# EAGLE design Cell Module v1 (EAGLE 8.2.2)
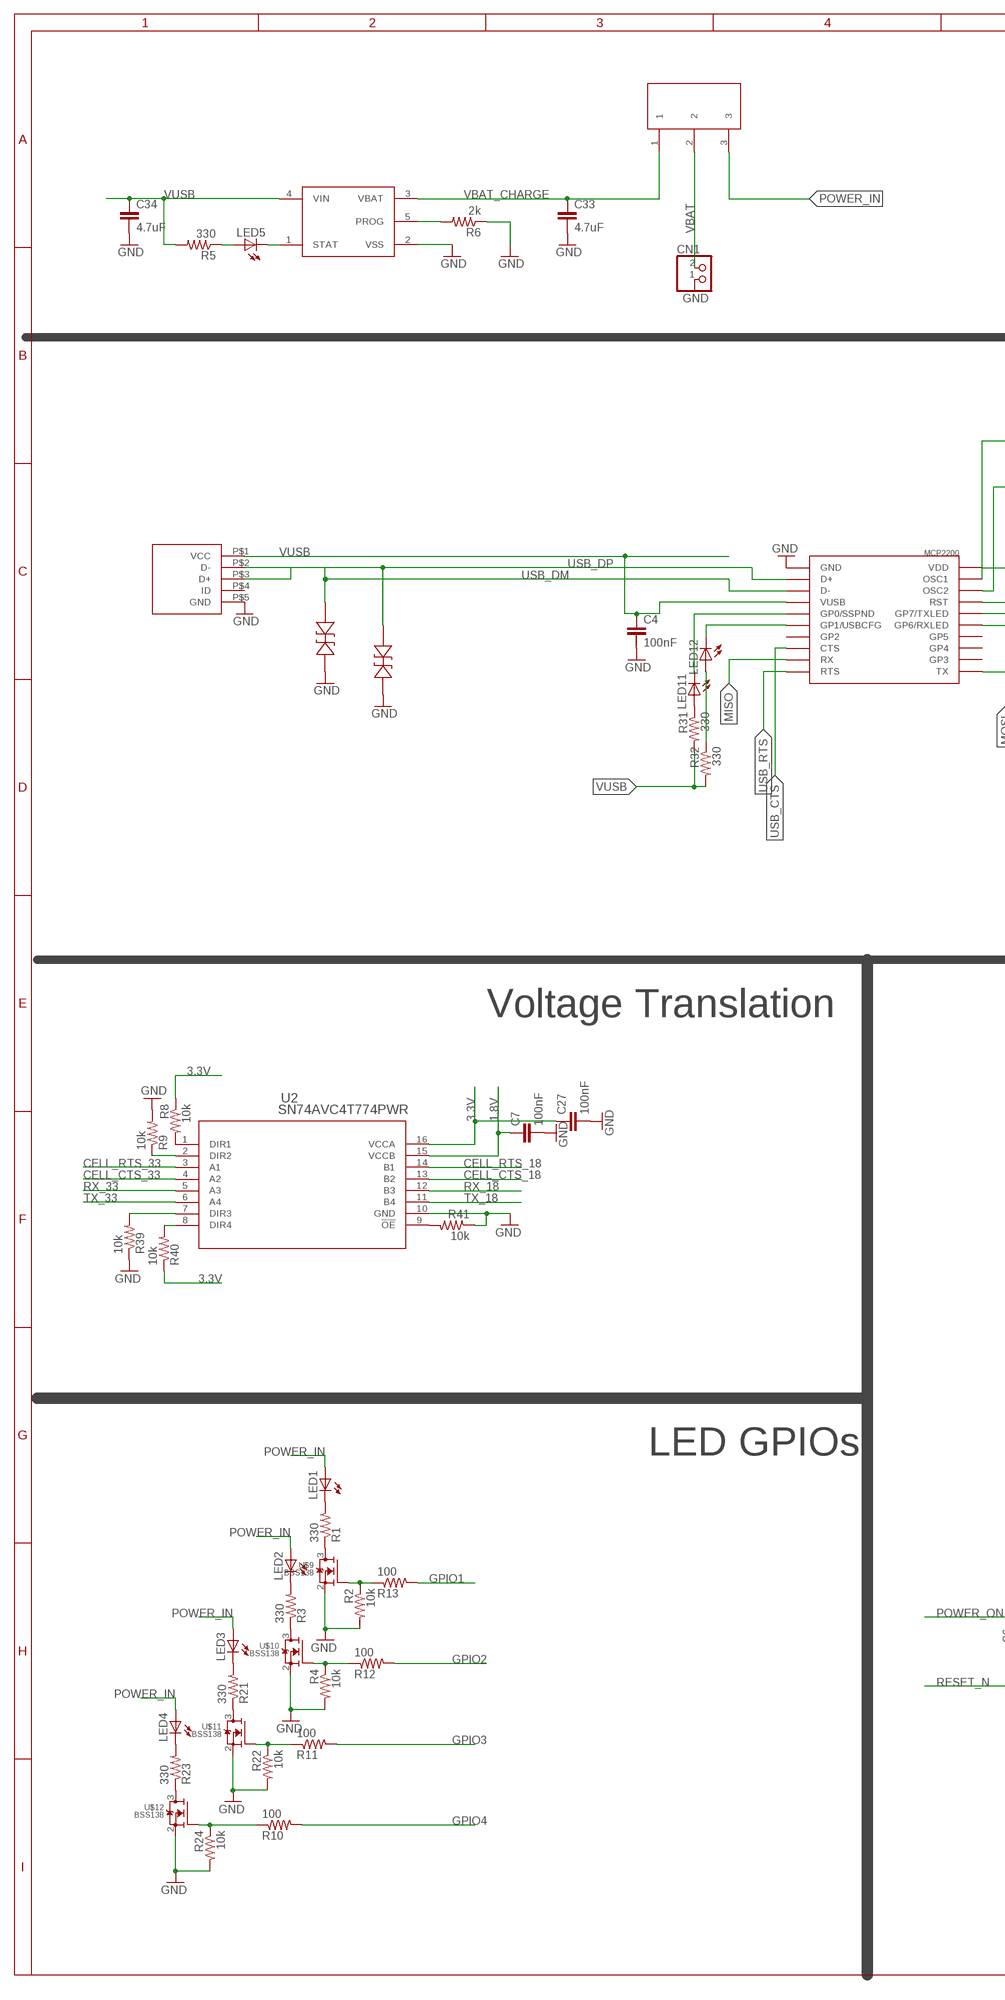
[diagram p0: schematic, sheet 1, part 1 of 2]
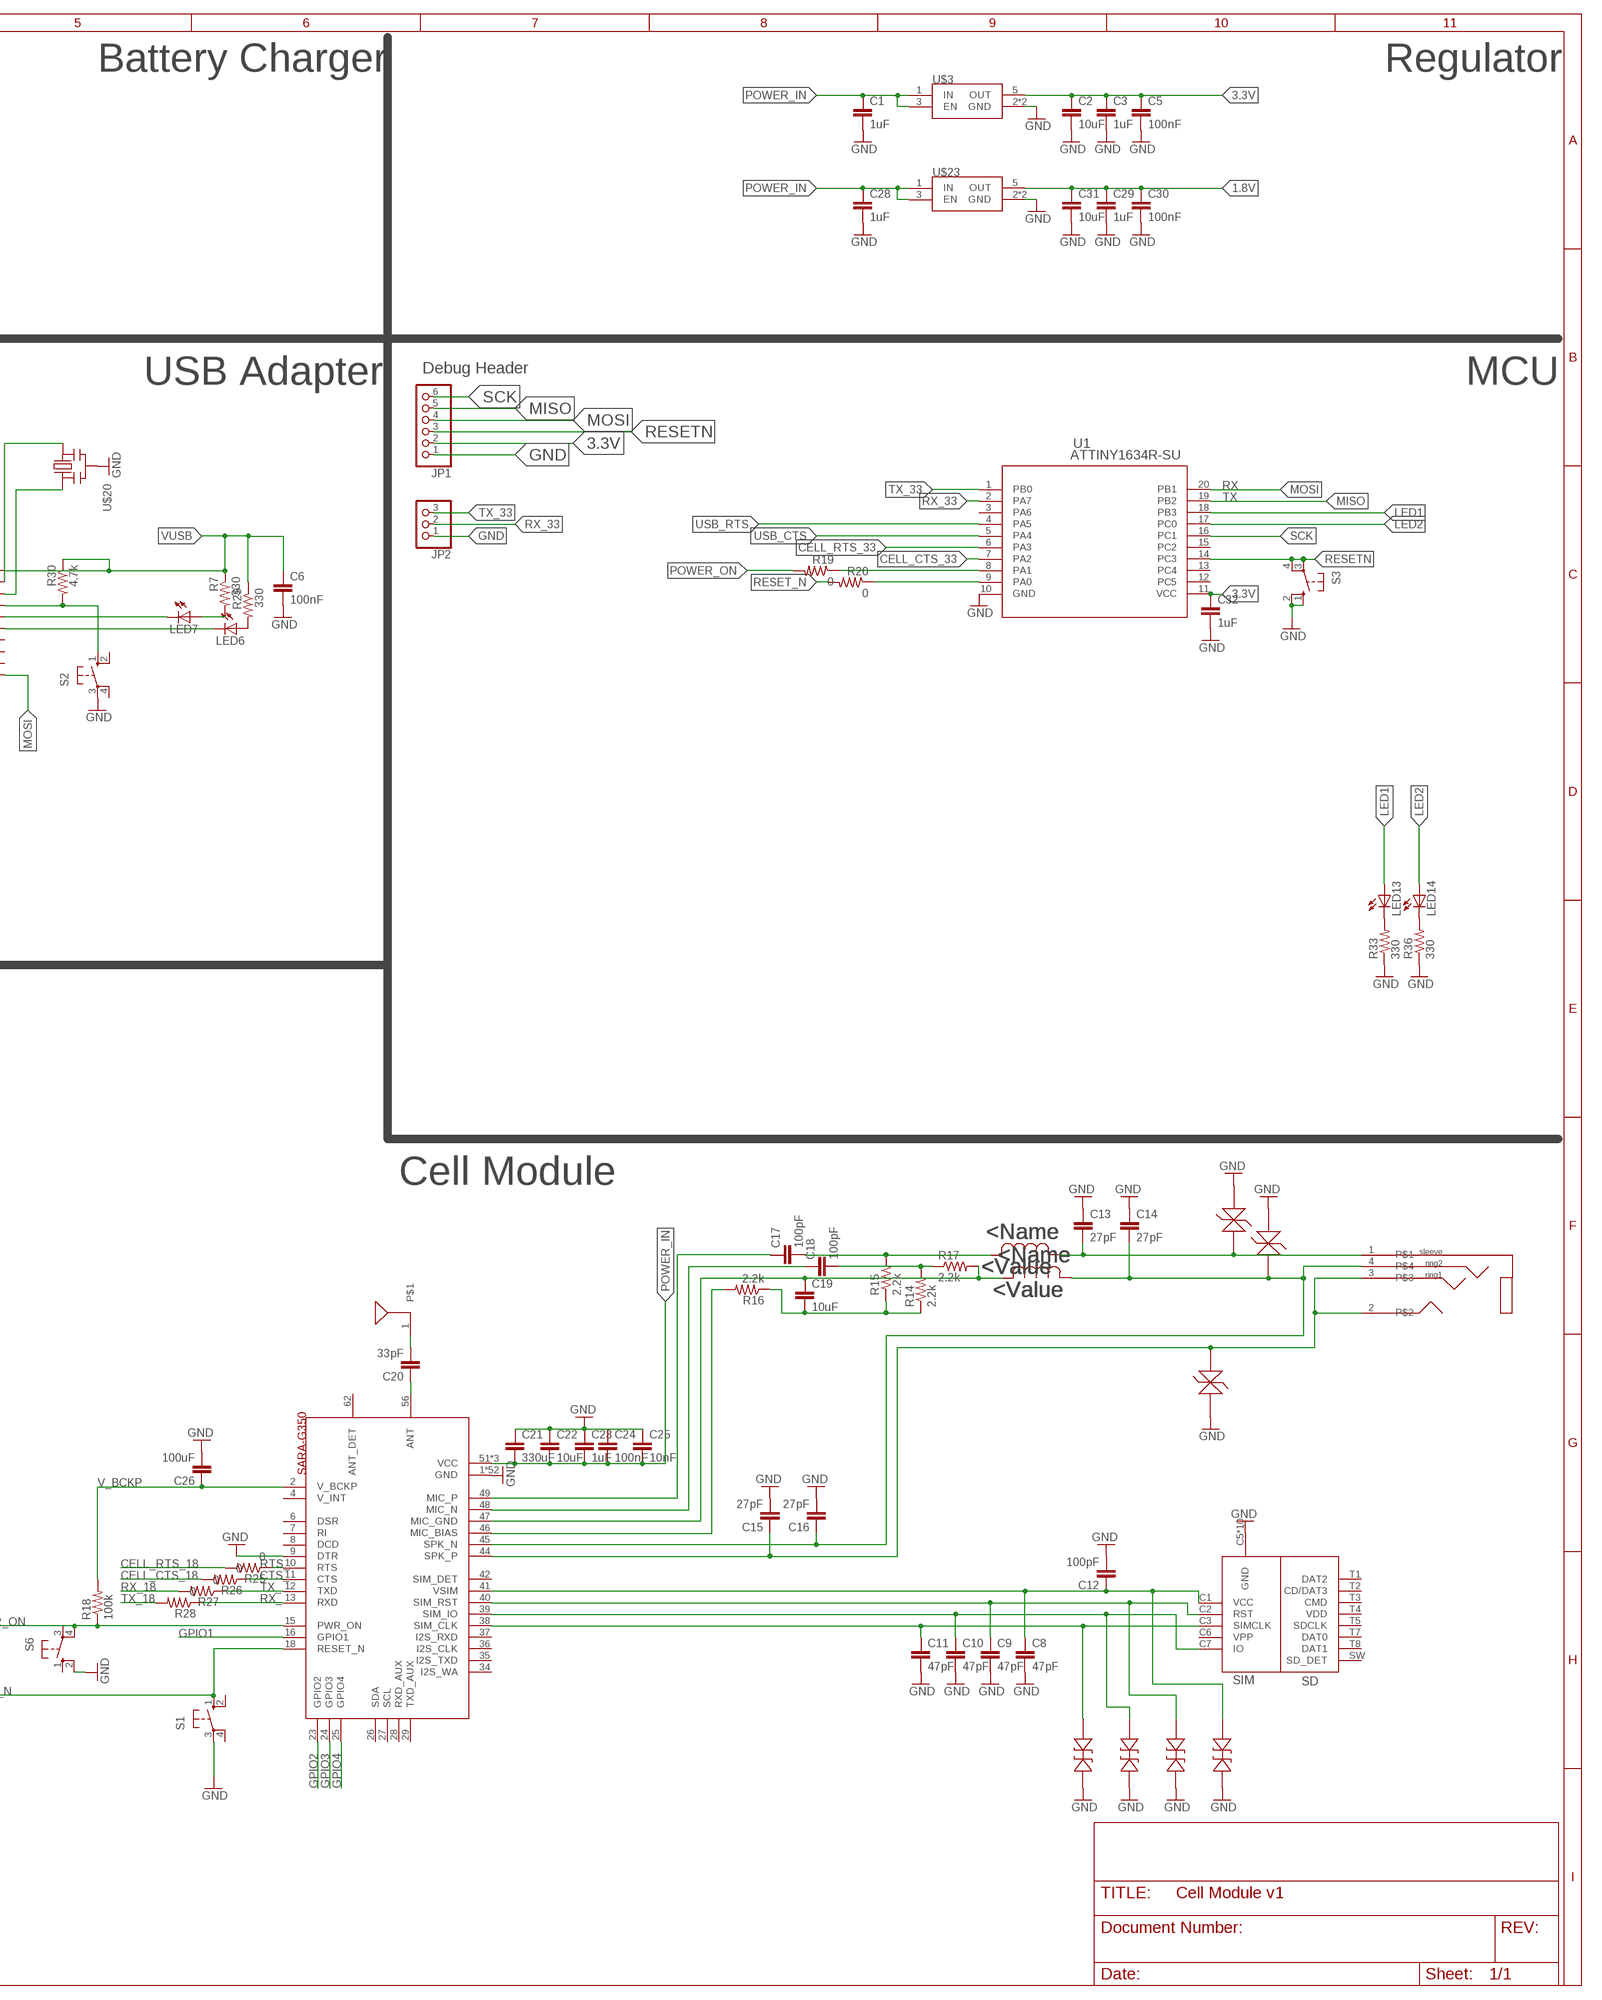
[diagram p1: schematic, sheet 1, part 2 of 2]

## Parts
C1  1uF  C-EUC0402  [C0402]
C2  10uF  C-EUC0603  [C0603]
C3  1uF  C-EUC0402  [C0402]
C4  100nF  C-EUC0402  [C0402]
C5  100nF  C-EUC0402  [C0402]
C6  100nF  C-EUC0402  [C0402]
C7  100nF  C-EUC0402  [C0402]
C8  47pF  C-EUC0402  [C0402]
C9  47pF  C-EUC0402  [C0402]
C10  47pF  C-EUC0402  [C0402]
C11  47pF  C-EUC0402  [C0402]
C12  100pF  C-EUC0402  [C0402]
C13  27pF  C-EUC0402  [C0402]
C14  27pF  C-EUC0402  [C0402]
C15  27pF  C-EUC0402  [C0402]
C16  27pF  C-EUC0402  [C0402]
C17  100pF  C-EUC0402  [C0402]
C18  100pF  C-EUC0402  [C0402]
C19  10uF  C-EUC0603  [C0603]
C20  33pF  C-EUC0402  [C0402]
C21  330uF  C-EUC1210  [C1210]
C22  10uF  C-EUC0603  [C0603]
C23  1uF  C-EUC0402  [C0402]
C24  100nF  C-EUC0402  [C0402]
C25  10nF  C-EUC0402  [C0402]
C26  100uF  C-EUC1206  [C1206]
C27  100nF  C-EUC0402  [C0402]
C28  1uF  C-EUC0402  [C0402]
C29  1uF  C-EUC0402  [C0402]
C30  100nF  C-EUC0402  [C0402]
C31  10uF  C-EUC0603  [C0603]
C32  1uF  C-EUC0402  [C0402]
C33  4.7uF  C-EUC0402  [C0402]
C34  4.7uF  C-EUC0402  [C0402]
CN1  JST_2PIN-THM  [JST-PH-2-THM]
CR1  PESD0402-140  [PESD0402]
CR2  PESD0402-140  [PESD0402]
CR3  PESD0402-140  [PESD0402]
CR4  PESD0402-140  [PESD0402]
CR5  PESD0402-140  [PESD0402]
CR6  PESD0402-140  [PESD0402]
JP1  PINHD-1X6  [1X06]
JP2  PINHD-1X3  [1X03]
LED1  LEDCHIP-LED0805  [CHIP-LED0805]
LED2  LEDCHIP-LED0805  [CHIP-LED0805]
LED3  LEDCHIP-LED0805  [CHIP-LED0805]
LED4  LEDCHIP-LED0805  [CHIP-LED0805]
LED5  LEDCHIP-LED0603  [CHIP-LED0603]
LED6  LEDCHIP-LED0805  [CHIP-LED0805]
LED7  LEDCHIP-LED0805  [CHIP-LED0805]
LED11  LEDCHIP-LED0805  [CHIP-LED0805]
LED12  LEDCHIP-LED0805  [CHIP-LED0805]
LED13  LEDCHIP-LED0805  [CHIP-LED0805]
LED14  LEDCHIP-LED0805  [CHIP-LED0805]
R1  330  R-US_R0402  [R0402]
R2  10k  R-US_R0402  [R0402]
R3  330  R-US_R0402  [R0402]
R4  10k  R-US_R0402  [R0402]
R5  330  R-US_R0402  [R0402]
R6  2k  R-US_R0402  [R0402]
R7  330  R-US_R0402  [R0402]
R8  10k  R-US_R0402  [R0402]
R9  10k  R-US_R0402  [R0402]
R10  100  R-US_R0402  [R0402]
R11  100  R-US_R0402  [R0402]
R12  100  R-US_R0402  [R0402]
R13  100  R-US_R0402  [R0402]
R14  2.2k  R-US_R0402  [R0402]
R15  2.2k  R-US_R0402  [R0402]
R16  2.2k  R-US_R0402  [R0402]
R17  2.2k  R-US_R0402  [R0402]
R18  100k  R-US_R0402  [R0402]
R19  0  R-US_R0402  [R0402]
R20  0  R-US_R0402  [R0402]
R21  330  R-US_R0402  [R0402]
R22  10k  R-US_R0402  [R0402]
R23  330  R-US_R0402  [R0402]
R24  10k  R-US_R0402  [R0402]
R25  0  R-US_R0402  [R0402]
R26  0  R-US_R0402  [R0402]
R27  0  R-US_R0402  [R0402]
R28  0  R-US_R0402  [R0402]
R29  330  R-US_R0402  [R0402]
R30  4.7k  R-US_R0402  [R0402]
R31  330  R-US_R0402  [R0402]
R32  330  R-US_R0402  [R0402]
R33  330  R-US_R0402  [R0402]
R36  330  R-US_R0402  [R0402]
R39  10k  R-US_R0402  [R0402]
R40  10k  R-US_R0402  [R0402]
R41  10k  R-US_R0402  [R0402]
S1  10-XX  [B3F-10XX]
S2  10-XX  [B3F-10XX]
S3  10-XX  [B3F-10XX]
S6  10-XX  [B3F-10XX]
U1  ATTINY1634R-SU  [20S2]
U2  SN74AVC4T774PWR  [PW16]
U$1  SARA-G350  [SARA-G350]
U$2  SIM_SD_MOLEX  [SIM_SD_MOLEX]
U$3  TPS782XX  [SOT23-5L]
U$4  MCP73831  [SOT23-5L]
U$5  MICRO_USB  [MOLEX_USB]
U$6  SPDT_THRU  [SPDT_THRU]
U$7  A10340  [A10340]
U$8  SJ-43514-SMT-TR  [SJ-43514-SMT-TR]
U$9  BSS138  [SOT23-3]
U$10  BSS138  [SOT23-3]
U$11  BSS138  [SOT23-3]
U$12  BSS138  [SOT23-3]
U$13  LQG15HS82NJ02  [0402]
U$14  LQG15HS82NJ02  [0402]
U$16  CG0402MLE-18G  [0402]
U$17  CG0402MLE-18G  [0402]
U$18  CG0402MLE-18G  [0402]
U$19  MCP2200  [SOIC20_65PITCH_LARGER]
U$20  CERMOSCILL-AWCSR  [AWCSR]
U$23  TPS782XX  [SOT23-5L]

## Nets
1.8V: C7.1 C29.1 C30.1 C31.1 U2.15(VCCB) U$23.5(OUT)
3.3V: C2.1 C3.1 C5.1 C27.1 C32.1 JP1.2 R8.1 R40.1 U1.11(VCC) U2.16(VCCA) U$3.5(OUT)
CELL_CTS_18: R26.2 U2.13(B2)
CELL_CTS_33: U1.7(PA2) U2.4(A2)
CELL_RTS_18: R25.2 U2.14(B1)
CELL_RTS_33: U1.6(PA3) U2.3(A1)
CTS_: R26.1 U$1.11(CTS)
GND: C1.2 C2.2 C3.2 C4.2 C5.2 C6.2 C7.2 C8.2 C9.2 C10.2 C11.2 C12.2 C13.1 C14.1 C15.2 C16.2 C21.1 C22.1 C23.1 C24.1 C25.1 C26.2 C27.2 C28.2 C29.2 C30.2 C31.2 C32.2 C33.2 C34.2 CN1.1 CR1.1 CR2.1 CR3.1 CR4.1 CR5.1 CR6.1 JP1.1 JP2.1 R2.2 R4.2 R6.1 R9.2 R22.2 R24.2 R33.1 R36.1 R39.1 R41.1 S1.3(P) S2.3(P) S3.1(S) S3.2(S1) S6.2(S1) U1.10(GND) U2.10(GND) U$1.1(GND) U$1.3(GND) U$1.5(GND) U$1.9(DTR) U$1.14(GND) U$1.20(GND) U$1.21(GND) U$1.22(GND) U$1.30(GND) U$1.32(GND) U$1.43(GND) U$1.50(GND) U$1.54(GND) U$1.55(GND) U$1.57(GND) U$1.58(GND) U$1.59(GND) U$1.60(GND) U$1.61(GND) U$1.63(GND) U$1.64(GND) U$1.65(GND) U$1.66(GND) U$1.67(GND) U$1.68(GND) U$1.69(GND) U$1.70(GND) U$1.71(GND) U$1.72(GND) U$1.73(GND) U$1.74(GND) U$1.75(GND) U$1.76(GND) U$1.77(GND) U$1.78(GND) U$1.79(GND) U$1.80(GND) U$1.81(GND) U$1.82(GND) U$1.83(GND) U$1.84(GND) U$1.85(GND) U$1.86(GND) U$1.87(GND) U$1.88(GND) U$1.89(GND) U$1.90(GND) U$1.91(GND) U$1.92(GND) U$1.93(GND) U$1.94(GND) U$1.95(GND) U$1.96(GND) U$2.C5(GND) U$2.G1(GND) U$2.G2(GND) U$2.G3(GND) U$2.G4(GND) U$2.G5(GND) U$2.G6(GND) U$2.G7(GND) U$2.G8(GND) U$2.T6(GND) U$3.2(GND) U$3.4(GND) U$4.2(VSS) U$5.P$5(GND) U$9.2(S) U$10.2(S) U$11.2(S) U$12.2(S) U$16.2 U$17.1 U$18.1 U$19.20(GND) U$20.2(GND) U$23.2(GND) U$23.4(GND)
GPIO1: R13.2 U$1.16(GPIO1)
GPIO2: R12.2 U$1.23(GPIO2)
GPIO3: R11.2 U$1.24(GPIO3)
GPIO4: R10.2 U$1.25(GPIO4)
LED1: LED13.A U1.18(PB3)
LED2: LED14.A U1.17(PC0)
MISO: JP1.5 U1.19(PB2) U$19.12(RX)
MOSI: JP1.4 U1.20(PB1) U$19.10(TX)
N$1: LED7.C U$19.5(GP7/TXLED)
N$2: LED6.C U$19.6(GP6/RXLED)
N$3: LED5.C U$4.1(STAT)
N$4: LED5.A R5.1
N$5: LED1.C R1.2
N$6: R6.2 U$4.5(PROG)
N$7: LED7.A R7.2
N$8: C11.1 CR1.2 U$1.38(SIM_CLK) U$2.C3(SIMCLK)
N$9: R1.1 U$9.3(D)
N$10: R8.2 U2.1(DIR1)
N$11: R9.1 U2.2(DIR2)
N$12: LED6.A R29.2
N$13: LED2.C R3.2
N$14: R3.1 U$10.3(D)
N$15: U$19.2(OSC1) U$20.3(OUT)
N$16: U$19.3(OSC2) U$20.1(IN)
N$17: LED3.C R21.2
N$18: C10.1 CR2.2 U$1.39(SIM_IO) U$2.C7(IO)
N$19: C9.1 CR3.2 U$1.40(SIM_RST) U$2.C2(RST)
N$20: C8.1 C12.1 CR4.2 U$1.41(VSIM) U$2.C1(VCC)
N$21: R16.2 U$1.46(MIC_BIAS)
N$22: C18.1 U$1.48(MIC_N)
N$23: C17.1 U$1.49(MIC_P)
N$24: C19.2 R14.1 R15.1 R16.1
N$25: C19.1 R17.2 U$1.47(MIC_GND) U$14.2
N$26: C18.2 R14.2 R17.1
N$27: C17.2 R15.2 U$13.2
N$28: C13.2 U$8.1 U$13.1 U$18.2
N$29: C14.2 C16.1 U$1.45(SPK_N) U$8.4 U$14.1 U$17.2
N$30: C15.1 U$1.44(SPK_P) U$8.2 U$8.3 U$16.1
N$31: C20.1 U$1.56(ANT)
N$32: C20.2 U$7.1
N$33: R30.2 S2.1(S) U$19.4(RST)
N$34: LED11.C U$19.16(GP0/SSPND)
N$35: LED12.C U$19.15(GP1/USBCFG)
N$36: LED11.A R31.1
N$37: LED12.A R32.1
N$38: R21.1 U$11.3(D)
N$39: R19.1 U1.8(PA1)
N$40: LED4.C R23.2
N$41: R23.1 U$12.3(D)
N$42: R20.1 U1.9(PA0)
N$43: LED13.C R33.2
N$44: LED14.C R36.2
N$45: R2.1 R13.1 U$9.1(G)
N$46: R4.1 R12.1 U$10.1(G)
N$47: R40.2 U2.8(DIR4)
N$48: R39.2 U2.7(DIR3)
N$49: R41.2 U2.9(!OE)
N$50: R11.1 R22.1 U$11.1(G)
N$51: R10.1 R24.1 U$12.1(G)
POWER_IN: C1.1 C21.2 C22.2 C23.2 C24.2 C25.2 C28.1 LED1.A LED2.A LED3.A LED4.A U$1.51(VCC) U$1.52(VCC) U$1.53(VCC) U$3.1(IN) U$3.3(EN) U$6.3 U$23.1(IN) U$23.3(EN)
POWER_ON: R18.1 R19.2 S6.3(P) S6.4(P1) U$1.15(PWR_ON)
RESET_N: R20.2 S1.1(S) U$1.18(RESET_N)
RESETN: JP1.3 S3.3(P) S3.4(P1) U1.14(PC3)
RTS_: R25.1 U$1.10(RTS)
RX_: R28.1 U$1.13(RXD)
RX_18: R27.2 U2.12(B3)
RX_33: JP2.2 U1.2(PA7) U2.5(A3)
SCK: JP1.6 U1.16(PC1)
TX_: R27.1 U$1.12(TXD)
TX_18: R28.2 U2.11(B4)
TX_33: JP2.3 U1.1(PB0) U2.6(A4)
USB_CTS: U1.5(PA4) U$19.13(CTS)
USB_DM: CR5.2 U$5.P$2(D-) U$19.18(D-)
USB_DP: CR6.2 U$5.P$3(D+) U$19.19(D+)
USB_RTS: U1.4(PA5) U$19.11(RTS)
V_BCKP: C26.1 R18.2 U$1.2(V_BCKP)
VBAT: CN1.2 U$6.2
VBAT_CHARGE: C33.1 U$4.3(VBAT) U$6.1
VUSB: C4.1 C6.1 C34.1 R5.2 R7.1 R29.1 R30.1 R31.2 R32.2 U$4.4(VIN) U$5.P$1(VCC) U$19.1(VDD) U$19.17(VUSB)
Unconnected: S1.2(S1) S1.4(P1) S2.2(S1) S2.4(P1) S6.1(S) U1.3(PA6) U1.12(PC5) U1.13(PC4) U1.15(PC2) U$1.4(V_INT) U$1.6(DSR) U$1.7(RI) U$1.8(DCD) U$1.26(SDA) U$1.27(SCL) U$1.28(RXD_AUX) U$1.29(TXD_AUX) U$1.34(I2S_WA) U$1.35(I2S_TXD) U$1.36(I2S_CLK) U$1.37(I2S_RXD) U$1.42(SIM_DET) U$1.62(ANT_DET) U$2.C6(VPP) U$2.SW(SD_DET) U$2.T1(DAT2) U$2.T2(CD/DAT3) U$2.T3(CMD) U$2.T4(VDD) U$2.T5(SDCLK) U$2.T7(DAT0) U$2.T8(DAT1) U$5.P$4(ID) U$19.7(GP5) U$19.8(GP4) U$19.9(GP3) U$19.14(GP2)

## Notes on the sheet
- Battery Charger | Regulator
- Debug Header
- USB Adapter | MCU
- RX
- TX
- Voltage Translation
- Cell Module
- LED GPIOs

## Library data of the parts
C1-C34 = rcl:C-EU: CAPACITOR, European symbol
CN1 = adafruit:JST_2PIN: JST 2-Pin Connectors of various flavors SMT-RA (S2B-PH-SM4) 4UConnector #17311 SMT (B2B-PH-SM4) THM-RA (S2B-PH) THM (B2B-PH)
CR1-CR6 = Charles:PESD0402-140; MANUFACTURER_PART_NUMBER: PESD0402140; VENDOR: Tyco Electronics
JP1 = adafruit:PINHD-1X6: PIN HEADER
JP2 = adafruit:PINHD-1X3: PIN HEADER
LED1-LED7 LED11-LED14 = adafruit:LED: LED OSRAM: - CHIPLED LG R971, LG N971, LY N971, LG Q971, LY Q971, LO R971, LY R971 LH N974, LH R974 LS Q976, LO Q976, LY Q976 LO Q996 - Hyper CHIPLED LW Q18S LB Q993, LB Q99A, LB R99A - SideLED LS A670, LO A670, LY A670, LG A670, LP A670 LB A673, LV A673, LT A673, LW A673 LH A674 LY A675 LS A676, LA A676, LO A676, LY A676, LW A676 LS A679, LY A679, LG A679 - Hyper Micro SIDELED® LS Y876, LA Y876, LO Y876, LY Y876 LT Y87S - SmartLED LW L88C, LW L88S LB L89C, LB L89S, LG L890 LS L89K, LO L89K, LY L89K LS L896, LA L896, LO L896, LY L896 - TOPLED LS T670, LO T670, LY T670, LG T670, LP T670 LSG T670, LSP T670, LSY T670, LOP T670, LYG T670 LG T671, LOG T671, LSG T671 LB T673, LV T673, LT T673, LW T673 LH T674 LS T676, LA T676, LO T676, LY T676, LB T676, LH T676, LSB T676, LW T676 LB T67C, LV T67C, LT T67C, LS T67K, LO T67K, LY T67K, LW E67C LS E67B, LA E67B, LO E67B, LY E67B, LB E67C, LV E67C, LT E67C LW T67C LS T679, LY T679, LG T679 LS T770, LO T770, LY T770, LG T770, LP T770 LB T773, LV T773, LT T773, LW T773 LH T774 LS E675, LA E675, LY E675, LS T675 LS T776, LA T776, LO T776, LY T776, LB T776 LHGB T686 LT T68C, LB T68C - Hyper Mini TOPLED® LB M676 - Mini TOPLED Santana® LG M470 LS M47K, LO M47K, LY M47K Source: http://www.osram.convergy.de/
R1-R33 R36 R39-R41 = rcl:R-US_: RESISTOR, American symbol
S1-S3 S6 = switch-omron:10-XX: OMRON SWITCH; MPN: B3F-1000; OC_FARNELL: 176432; OC_NEWARK: 36M3542
U1 = Charles:ATTINY1634R-SU: 8-bit Atmel tinyAVR Microcontroller with 16K Bytes In-System Programmable Flash; MANUFACTURER_PART_NUMBER: attiny1634rsu; VENDOR: ATMEL
U2 = Charles:SN74AVC4T774PWR: 4-Bit Dual-Supply Bus Transceiver With Configurable Voltage Translation and 3-State Outputs; MANUFACTURER_PART_NUMBER: SN74AVC4T774PWR; VENDOR: Texas Instruments
U$1 = Charles:SARA-G350
U$2 = Charles:SIM_SD_MOLEX
U$3 U$23 = James_Updated:TPS782XX: TPS782 500-nA IQ,150-mA, Ultra-Low Quiescent Current Low-Dropout Linear Regulator
U$4 = James_Updated:MCP73831
U$5 = James_Updated:MICRO_USB: Molex Micro USB AB RA SMD Bottom Mount
U$6 = James_Updated:SPDT_THRU
U$7 = Charles:A10340: Pentaband SMD Antenna 850MHz, 900MHz, 1.8GHz, 1.9GHz GSM, UMTS PCB Trace RF Antenna 824MHz ~ 960MHz, 1.71GHz ~ 2.17GHz 1.7dBi, 3dBi Solder Surface Mount
U$8 = Charles:SJ-43514-SMT-TR: 3.50mm (0.141", 1/8", Mini Plug) - Headphone Phone Jack Multiple Connector Solder
U$9-U$12 = Charles:BSS138: MOSFET N-CH 50V 220MA
U$13 U$14 = Charles:LQG15HS82NJ02: 82nH Unshielded Multilayer Inductor 200mA 1.2 Ohm Max 0402 (1005 Metric)
U$16-U$18 = Charles:CG0402MLE-18G: ChipGuard® MLE Series Varistor ESD Clamp Protectors
U$19 = Charles:MCP2200: USB 2.0 to UART Protocol Converter with GPIO
U$20 = adafruit:CERMOSCILL: Ceramic oscillator with built in capacitors such as ZTT-12MHz http://www.ladyada.net/library/eagle

## Board
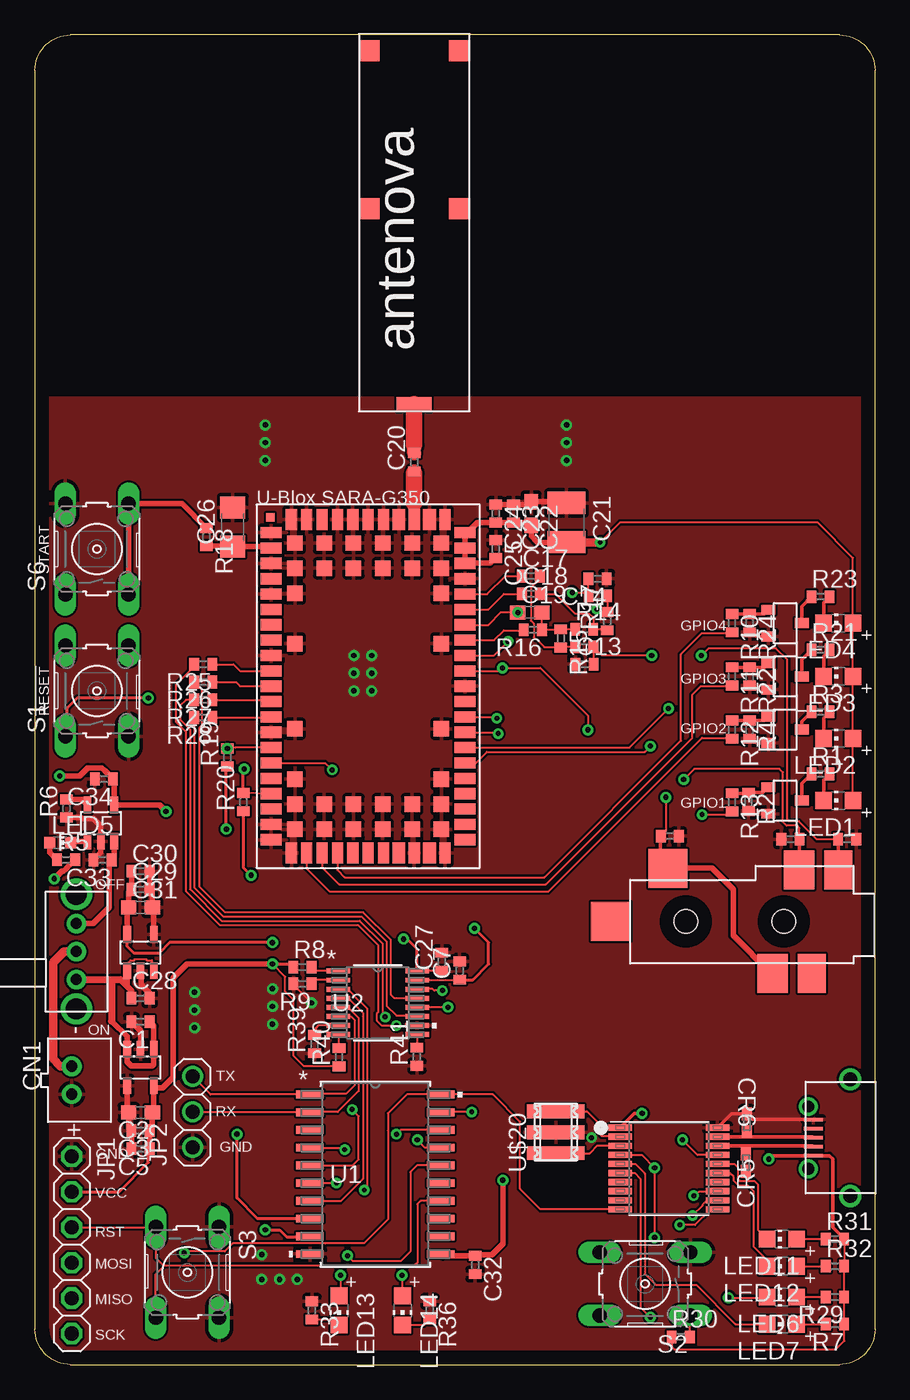
[diagram p2: board, top side]
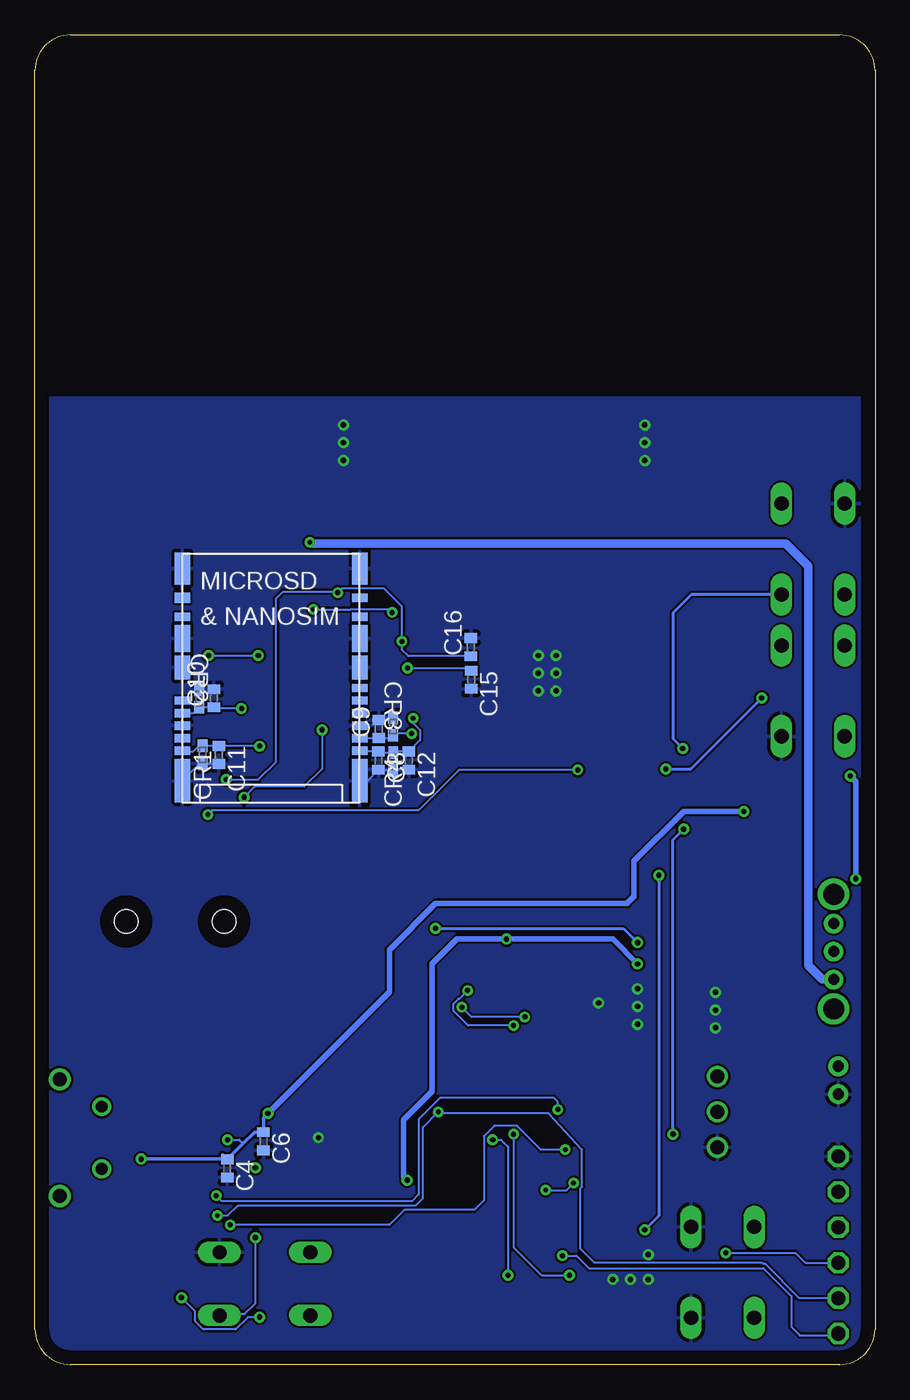
[diagram p3: board, bottom side, seen from below]

Size 60.2 x 95.25 mm. Coordinates in mm from the lower left corner, seen from the top.
Outline: 2.54,0 57.66,0 arc90 60.2,2.54 60.2,92.71 arc90 57.66,95.25 2.54,95.25 arc90 0,92.71 0,2.54 arc90 2.54,0
Copper layers (1*16): Top 0.035mm / dielectric 1.5mm / Bottom 0.035mm
Design rules "default *": minimum track width 10mil, minimum drill 24mil, track to track 6mil, track to pad 6mil, pad to pad 6mil, via to via 6mil, smd to smd 6mil, copper to edge 40mil, drill to drill 8mil, minimum pad ring 10mil, minimum via ring 8mil, stop-mask expansion 4mil, vias tented up to drill 0mil, thermal gap 10mil

### Footprints (pad centres in the part's own frame; a part is rotated, then mirrored left to right if it is on the bottom)
C0402 = smd 0.7 x 0.9: 1 -0.65,0; 2 0.65,0
C0603 = smd 1.1 x 1: 1 -0.85,0; 2 0.85,0
C1210 = smd 1.6 x 2.7: 1 -1.4,0; 2 1.4,0
C1206 = smd 1.6 x 1.8: 1 -1.4,0; 2 1.4,0
JST-PH-2-THM = drill 0.8 pad 1.422: 1 1,0; 2 -1,0
PESD0402 = smd 0.902 x 0.711: 1 -0.629,0; 2 0.629,0
1X06 = drill 1.016 octagon: 1 -6.35,0; 2 -3.81,0; 3 -1.27,0; 4 1.27,0; 5 3.81,0; 6 6.35,0
1X03 = drill 1.016: 1 -2.54,0; 2 0,0; 3 2.54,0
CHIP-LED0805 = smd 1.2 x 1.2: A 0,-1.05; C 0,1.05
CHIP-LED0603 = smd 0.8 x 0.8: A 0,-0.75; C 0,0.75
R0402 = smd 0.7 x 0.9: 1 -0.65,0; 2 0.65,0
B3F-10XX = drill 1.016 long: 1 -3.251,2.261; 2 3.251,2.261; 3 -3.251,-2.261; 4 3.251,-2.261
20S2 = smd 1.981 x 0.561: 1 -4.69,5.715; 2 -4.69,4.445; 3 -4.69,3.175; 4 -4.69,1.905; 5 -4.69,0.635; 6 -4.69,-0.635; 7 -4.69,-1.905; 8 -4.69,-3.175; 9 -4.69,-4.445; 10 -4.69,-5.715; 11 4.69,-5.715; 12 4.69,-4.445; 13 4.69,-3.175; 14 4.69,-1.905; 15 4.69,-0.635; 16 4.69,0.635; 17 4.69,1.905; 18 4.69,3.175; 19 4.69,4.445; 20 4.69,5.715
PW16 = smd 1.676 x 0.356: 1 -2.819,2.275; 2 -2.819,1.625; 3 -2.819,0.975; 4 -2.819,0.325; 5 -2.819,-0.325; 6 -2.819,-0.975; 7 -2.819,-1.625; 8 -2.819,-2.275; 9 2.819,-2.275; 10 2.819,-1.625; 11 2.819,-0.975; 12 2.819,-0.325; 13 2.819,0.325; 14 2.819,0.975; 15 2.819,1.625; 16 2.819,2.275
SARA-G350 = smd 1.5 x 0.8: 1 1.05,-2; 2 1.05,-3.1; 3 1.05,-4.2; 4 1.05,-5.3; 5 1.05,-6.4; 6 1.05,-7.5; 7 1.05,-8.6; 8 1.05,-9.7; 9 1.05,-10.8; 10 1.05,-11.9; 11 1.05,-13; 12 1.05,-14.1; 13 1.05,-15.2; 14 1.05,-16.3; 15 1.05,-17.4; 16 1.05,-18.5; 17 1.05,-19.6; 18 1.05,-20.7; 19 1.05,-21.8; 20 1.05,-22.9; 21 1.05,-24; 33 14.95,-24; 34 14.95,-22.9; 35 14.95,-21.8; 36 14.95,-20.7; 37 14.95,-19.6; 38 14.95,-18.5; 39 14.95,-17.4; 40 14.95,-16.3; 41 14.95,-15.2; 42 14.95,-14.1; 43 14.95,-13; 44 14.95,-11.9; 45 14.95,-10.8; 46 14.95,-9.7; 47 14.95,-8.6; 48 14.95,-7.5; 49 14.95,-6.4; 50 14.95,-5.3; 51 14.95,-4.2; 52 14.95,-3.1; 53 14.95,-2 | smd 0.8 x 1.5: 22 2.5,-24.95; 23 3.6,-24.95; 24 4.7,-24.95; 25 5.8,-24.95; 26 6.9,-24.95; 27 8,-24.95; 28 9.1,-24.95; 30 11.3,-24.95; 32 13.5,-24.95; 54 13.5,-1.05; 56 11.3,-1.05; 58 9.1,-1.05; 59 8,-1.05; 60 6.9,-1.05; 61 5.8,-1.05; 62 4.7,-1.05; 63 3.6,-1.05; 64 2.5,-1.05 | smd 0.9 x 1.5: 29 10.2,-24.95; 31 12.4,-24.95; 55 12.4,-1.05; 57 10.2,-1.05 | smd 1.1 x 1.1: 65 2.75,-2.75; 66 4.85,-2.75; 67 6.95,-2.75; 68 9.05,-2.75; 69 11.15,-2.75; 70 13.25,-2.75; 71 2.75,-4.55; 72 4.85,-4.55; 73 6.95,-4.55; 74 9.05,-4.55; 75 11.15,-4.55; 76 13.25,-4.55; 77 2.75,-6.35; 78 13.25,-6.35; 79 2.75,-9.95; 80 13.25,-9.95; 81 2.75,-16.05; 82 13.25,-16.05; 83 2.75,-19.65; 84 13.25,-19.65; 85 2.75,-21.45; 86 4.85,-21.45; 87 6.95,-21.45; 88 9.05,-21.45; 89 11.15,-21.45; 90 13.25,-21.45; 91 2.75,-23.25; 92 4.85,-23.25; 93 6.95,-23.25; 94 9.05,-23.25; 95 11.15,-23.25; 96 13.25,-23.25 | smd 0.6 x 0.6: P$1 1,-0.9
SIM_SD_MOLEX = smd 1.1 x 0.6: C1 6.35,3.7; C2 6.35,4.6; C3 -6.35,3.7; C5 6.35,5.5; C6 -6.35,4.6; C7 -6.35,6.4; T1 6.35,14.665; T2 6.35,13.31; T3 6.35,8.2; T4 6.35,7.3; T5 6.35,6.4; T6 -6.35,5.5; T7 -6.35,7.3; T8 -6.35,13.31 | smd 1.1 x 3.1: G1 -6.35,1.55; G8 6.35,1.55 | smd 1.1 x 1.72: G2 -6.35,9.66; G7 6.35,9.66 | smd 1.1 x 1.94: G3 -6.35,11.74; G6 6.35,11.74 | smd 1.1 x 2.3: G4 -6.35,16.75; G5 6.35,16.75 | smd 1.1 x 0.75: SW -6.35,14.665
SOT23-5L = smd 0.55 x 1.2: 1 -0.95,-1.3; 2 0,-1.3; 3 0.95,-1.3; 4 0.95,1.3; 5 -0.95,1.3
MOLEX_USB = smd 0.25 x 1.35: P$1 -1.3,2.65; P$2 -0.65,2.65; P$3 0,2.65; P$4 0.65,2.65; P$5 1.3,2.65 | drill 0.85 pad 1.206: P$6 -2.225,3; P$7 2.225,3 | drill 1 pad 1.6: P$8 -4.175,0; P$9 4.175,0
SPDT_THRU = drill 0.787 pad 1.397: 1 -2.007,0; 2 0,0; 3 2.007,0 | drill 1.499: A1 -4.102,0; A2 4.102,0
A10340 = smd 2.5 x 1: 1 0,0 | smd 1.5 x 1.5: 2 -3.25,14; 3 3.25,14; 4 3.25,25.31; 5 -3.25,25.31
SJ-43514-SMT-TR = smd 2 x 2.8: 1 0.6,-3.7; 6 2.5,3.7 | smd 2.8 x 2.8: 2 12.8,-3.81; 5 16.9,0 | smd 2.2 x 2.8: 3 5.3,3.7; 4 3.4,-3.7 | hole 1.7: 4.5,0; 11.5,0
SOT23-3 = smd 0.7 x 1: 1 -0.95,-1.2; 2 0.95,-1.2; 3 0,1.2
0402 = smd 0.7 x 0.9: 1 -0.65,0; 2 0.65,0
SOIC20_65PITCH_LARGER = smd 1.7 x 0.45: 1 -3.49,2.925; 2 -3.49,2.275; 3 -3.49,1.625; 4 -3.49,0.975; 5 -3.49,0.325; 6 -3.49,-0.325; 7 -3.49,-0.975; 8 -3.49,-1.625; 9 -3.49,-2.275; 10 -3.49,-2.925; 11 3.49,-2.925; 12 3.49,-2.275; 13 3.49,-1.625; 14 3.49,-0.975; 15 3.49,-0.325; 16 3.49,0.325; 17 3.49,0.975; 18 3.49,1.625; 19 3.49,2.275; 20 3.49,2.925
AWCSR = smd 1 x 4.1: 1 -1.5,0; 2 0,0; 3 1.5,0

### Placement (x,y rotation side)
C1  7.57,24.56 180 top
C2  7.57,18.06 180 top
C3  7.57,16.76 180 top
C4  46.42,14.05 270 bottom
C5  7.57,15.46 180 top
C6  43.82,16 270 bottom
C7  30.43,28.22 90 top
C8  35.58,43.27 270 bottom
C9  35.55,45.53 90 bottom
C10  47.38,47.73 90 bottom
C11  47.02,43.67 270 bottom
C12  33.41,43.27 270 bottom
C13  39.38,50.17 0 top
C14  40.31,56.3 180 top
C15  28.94,49.05 270 bottom
C16  28.96,51.4 90 bottom
C17  35.55,56.48 0 top
C18  35.55,55.22 0 top
C19  35.45,53.88 0 top
C20  27.18,64.64 90 top
C21  38.09,60.33 270 top
C22  35.56,60.96 270 top
C23  34.29,60.96 270 top
C24  33.02,60.96 270 top
C25  33.02,58.42 270 top
C26  14.18,59.99 90 top
C27  29.16,28.86 90 top
C28  7.57,26.24 0 top
C29  7.57,34.04 0 top
C30  7.57,35.34 0 top
C31  7.57,32.74 0 top
C32  31.55,7.13 270 top
C33  4.85,36.15 180 top
C34  4.95,41.95 180 top
CN1  2.65,20.38 270 top
CR1  48.18,43.69 90 bottom
CR2  48.42,47.71 270 bottom
CR3  34.55,45.71 270 bottom
CR4  34.52,43.19 90 bottom
CR5  50.95,14.47 90 top
CR6  51,17.33 270 top
JP1  2.65,8.57 270 top
JP2  11.3,18.1 90 top
LED1  57.56,40.41 90 top
LED2  57.56,44.85 90 top
LED3  57.56,49.3 90 top
LED4  57.56,53.11 90 top
LED5  1.81,37.38 270 top
LED6  53.52,4.84 90 top
LED7  53.52,2.89 90 top
LED11  53.52,9 90 top
LED12  53.52,7.05 90 top
LED13  21.8,3.88 180 top
LED14  26.34,3.88 180 top
R1  56.29,42.31 0 top
R2  51.12,40.32 270 top
R3  56.29,46.76 0 top
R4  51.21,45.48 270 top
R5  2.23,36.16 0 top
R6  2.27,39.84 90 top
R7  57.33,2.89 180 top
R8  19.17,28.46 0 top
R9  19.17,27.27 180 top
R10  49.94,53.11 270 top
R11  49.94,49.3 270 top
R12  49.94,45.48 270 top
R13  49.94,40.28 270 top
R14  39.35,52.67 0 top
R15  37.69,52.02 270 top
R16  35.67,52.65 180 top
R17  41.01,53.26 90 top
R18  12.29,59.27 270 top
R19  13.79,43.49 90 top
R20  14.94,40.29 90 top
R21  56.29,51.2 0 top
R22  51.21,49.3 270 top
R23  56.29,55.01 0 top
R24  51.21,53.11 270 top
R25  12.06,50.16 180 top
R26  12.06,48.9 180 top
R27  12.06,47.62 180 top
R28  12.06,46.35 180 top
R29  57.33,4.84 180 top
R30  46.27,1.99 0 top
R31  57.33,9 0 top
R32  57.33,7.05 0 top
R33  19.84,3.88 270 top
R36  28.3,3.88 270 top
R39  20.04,22.96 90 top
R40  21.79,22.02 90 top
R41  27.37,22.05 90 top
S1  4.45,48.26 90 top
S2  43.72,5.78 180 top
S3  10.93,6.61 270 top
S6  4.45,58.42 90 top
U1  24.39,13.63 0 top
U2  24.57,25.91 0 top
U$1  15.88,61.59 0 top
U$2  43.28,40.27 0 bottom
U$3  7.57,21.28 180 top
U$4  4.72,38.78 0 top
U$5  58.42,16.26 90 top
U$6  2.96,29.59 270 top
U$7  27.18,68.8 0 top
U$8  58.15,31.73 180 top
U$9  53.75,40.41 270 top
U$10  53.75,45.48 270 top
U$11  53.75,49.3 270 top
U$12  53.75,53.11 270 top
U$13  39.38,51.41 180 top
U$14  40.33,55.08 0 top
U$16  45.49,37.87 0 top
U$17  54.13,37.63 0 top
U$18  58.2,37.63 180 top
U$19  45.42,14.05 0 top
U$20  37.32,16.65 90 top
U$23  7.57,29.52 0 top

### Tracks (layer width: path | path; a pad name or v marks a point on that pad's centre or on a via)
1.8V  (via drill 0.38)
  Top 0.152: U2.15 30.4,27.54 C7.1
  Top 0.203: C7.1 31.38,27.57 32.51,28.7 32.51,30.23 v31.5,31.24 | v17.02,30.23 9.65,30.23 8.89,29.46 7.11,29.46 6.6,29.97 6.6,30.8 U$23.5
  Top 0.406: U$23.5 6.62,32.64 C31.1 6.72,33.84 C29.1 C30.1
  Bottom 0.203: v31.5,31.24 18.03,31.24 v17.02,30.23
3.3V  (via drill 0.38)
  Top 0.152: 31.41,7.92 C32.1 31.63,7.87 | U2.16 29.14,28.19 C27.1 | R40.1 19.27,21.37 18.54,22.1 18.54,26.13 17.94,26.73 17.94,27.78 v17.02,28.7
  Top 0.203: JP1.2 6.03,12.38 8.13,14.48 8.13,15.37 C5.1 | U2.16 27.38,29.77 26.67,30.48 v26.42,30.48 | v17.02,28.7 18.28,28.7 R8.1 | 8.69,19.81 U$3.5
  Top 0.406: C5.1 C3.1 8.42,16.96 C2.1 8.52,18.16 U$3.5 | v17.02,28.7 10.92,28.7 9.91,27.69 9.91,20.57 9.14,19.81 8.69,19.81 | v33.53,13.21 33.53,8.64 32.77,7.87 31.63,7.87 | C32.1 29.22,7.79 U1.11
  Bottom 0.406: v17.02,28.7 18.8,30.48 v26.42,30.48 29.97,30.48 31.75,28.7 31.75,19.56 33.78,17.53 33.78,13.46 v33.53,13.21
CELL_CTS_18
  Top 0.152: U2.13 25.76,26.24 25.5,26.5 25.5,30.43 23.53,32.41 13.63,32.41 11.82,34.22 11.82,45.63 11.99,45.81 11.99,48.32 R26.2
CELL_CTS_33
  Top 0.152: U2.4 22.46,26.24 23.5,25.2 23.5,24.96 23.51,24.95 23.51,13.31 21.9,11.7 19.73,11.7 U1.7
CELL_RTS_18  (via drill 0.35)
  Top 0.152: R25.2 11.41,50.02 10.1,48.7 10.1,46.07 10.8,45.36 10.8,33.93 13.25,31.49 23.15,31.49 24.57,30.07 24.57,25.23 24.49,25.15 24.49,24.65 24.85,24.29 v25.9,24.29 | v29.2,26.8 28.6,26.8 28.5,26.9 27.39,26.9 U2.14
  Bottom 0.152: v29.2,26.8 29.79,26.21 29.85,26.21 30.21,25.85 30.21,25.35 29.15,24.29 v25.9,24.29
CELL_RTS_33  (via drill 0.35)
  Top 0.152: U2.3 22.43,26.89 22.81,26.51 22.81,26.49 23.8,25.5 23.8,25.33 23.81,25.32 23.81,12.71 v23.6,12.5 | v21.6,13 U1.6
  Bottom 0.152: v23.6,12.5 22.1,12.5 v21.6,13
CTS_
  Top 0.152: R26.1 14.4,48.9 14.7,48.6 U$1.11
GND  (via drill 0.35, 0.38)
  Top 0.152: R9.2 18.52,27.2 v19.81,25.91 | U$12.2 51.51,52.16 R24.2
  Top 0.254: U$5.P$5 51.4,17.56 CR6.1 49.89,17.96 U$19.20
  Top 0.406: U$23.4 8.52,32.64 C31.2 8.42,33.84 C29.2 C30.2 | C28.2 8.22,26.58 7.6,27.2 7.6,28.18 U$23.2 | U$3.2 7.57,23.91 7.51,23.96 7.51,23.97 C1.2 | U$3.4 6.62,18.16 C2.2 6.72,16.96 C3.2 C5.2 | C33.2 4.72,36.68 U$4.2 4.7,37.51 4.7,38.6 4.17,39.13 3.35,39.13 3.3,39.19 R6.1 | C24.1 C23.1 35.36,61.61 C22.1 38,61.81 C21.1
  Bottom 0.152: C11.2 48.14,43.02 CR1.1 48.39,43.06 U$2.G1 | C12.2 34.46,42.62 CR4.1 35.52,42.56 C8.2 36.38,41.82 U$2.G8
  other vias: 16.26,6.1 17.53,6.1 18.8,6.1 11.43,24.13 11.43,25.4 11.43,26.67 17.02,24.38 17.02,25.65 17.02,26.92 16.26,7.87 39.88,16.26 22.86,48.26 22.86,49.53 22.86,50.8 24.13,48.26 24.13,49.53 24.13,50.8 16.51,64.77 16.51,66.04 16.51,67.31 38.1,64.77 38.1,66.04 38.1,67.31
  pour Top: -1.27,69.22 65.41,69.22 65.41,-2.54 -1.27,-2.54
  pour Bottom: -1.91,69.22 66.67,69.22 66.67,-3.81 -1.91,-3.81
GPIO1  (via drill 0.35)
  Top 0.152: U$1.16 20.8,43.09 v21.3,42.6 | v47.8,39.4 49.71,39.4 R13.2
  Bottom 0.152: v21.3,42.6 29.8,42.6 32.7,39.7 47.5,39.7 v47.8,39.4
GPIO2
  Top 0.152: U$1.23 19.48,35.52 21.1,33.9 36.8,33.9 47.8,44.9 49.88,44.9 R12.2
GPIO3
  Top 0.152: U$1.24 20.57,35.62 21.8,34.4 36.6,34.4 47.1,44.9 47.1,48 47.7,48.6 49.9,48.6 R11.2
GPIO4
  Top 0.152: U$1.25 21.68,35.42 22.2,34.9 36.5,34.9 46.3,44.7 46.3,50.9 47.8,52.4 49.88,52.4 R10.2
LED1  (via drill 0.35, 0.38)
  Top 0.152: v21.9,6.4 21.9,5.04 LED13.A | U1.18 26.21,16.81 v25.9,16.5
  Bottom 0.152: v21.9,6.4 21.94,6.44 21.98,6.4 23.9,6.4 25.9,8.4 v25.9,16.5
LED2  (via drill 0.38)
  Top 0.152: U1.17 27.96,15.54 v27.4,16.1 | v26.3,6.4 26.3,4.98 LED14.A
  Bottom 0.152: v27.4,16.1 26.8,16.1 26.3,15.6 v26.3,6.4
MISO  (via drill 0.35)
  Top 0.152: v47.12,10.68 47.83,11.39 47.83,11.45 48.16,11.78 U$19.12 | v31.3,18.1 29.11,18.1 U1.19
  Bottom 0.152: v47.12,10.68 46.38,10.68 45.65,11.4 32.9,11.4 32.4,11.9 32.4,17 v31.3,18.1 31.2,18 23.4,18 20.99,15.39 20.99,12.75 21.1,12.64 21.1,8.3 20.1,7.3 8.1,7.3 8.01,7.21 7.87,7.21 5.43,4.76 JP1.5
MOSI  (via drill 0.35)
  Top 0.152: U$19.10 36.24,11.12 34.76,12.6 34.76,17.4 32.81,19.35 U1.20 26.65,19.35 25.3,18 25.3,16.76 25.29,16.75 25.29,10.39 23.6,8.7 20.81,8.7 20.79,8.68 14.17,8.68 13.6,8.11 10.81,8.11 v10.7,8
  Bottom 0.152: v10.7,8 5.7,8 5,7.3 JP1.4
N$1
  Top 0.152: U$19.5 43.02,14.38 43.7,13.7 43.7,6.5 44.5,5.7 47.4,5.7 50.2,2.9 52.46,2.9 LED7.C
N$2  (via drill 0.38)
  Top 0.152: U$19.6 42.98,13.72 43.4,13.3 43.4,4.11 v44.1,3.4 | v49.7,4.8 52.42,4.8 LED6.C
  Bottom 0.152: v49.7,4.8 48.72,3.82 48.72,3.11 48.14,2.53 45.8,2.53 44.93,3.4 v44.1,3.4
N$3
  Top 0.406: U$4.1 2.67,37.48 LED5.C
N$4
  Top 0.406: LED5.A 1.06,36.67 R5.1
N$5
  Top 0.254: LED1.C 56.51,41.88 R1.2
N$6
  Top 0.406: R6.2 3.38,40.48 U$4.5
N$7
  Top 0.152: LED7.A R7.2
N$8  (via drill 0.35)
  Top 0.152: U$1.38 31.59,43.09 32.39,43.89 43.69,43.89 v44.1,44.3
  Bottom 0.152: U$2.C3 49.56,43.9 48.9,43.9 48.48,44.32 CR1.2 C11.1 47,44.3 v44.1,44.3
N$9
  Top 0.254: U$9.3 54.95,41.62 R1.1
N$10
  Top 0.152: U2.1 20.09,28.19 R8.2
N$11
  Top 0.152: U2.2 20.08,27.54 R9.1
N$12
  Top 0.152: LED6.A R29.2
N$13
  Top 0.254: LED2.C 56.51,46.33 R3.2
N$14
  Top 0.254: U$10.3 54.95,46.06 R3.1
N$15
  Top 0.152: U$20.3 39.55,18.15 40.3,17.4 40.3,16.7 40.6,16.4 41.85,16.4 U$19.2
N$16
  Top 0.152: U$20.1 39.75,15.15 40.3,15.7 41.91,15.7 U$19.3
N$17
  Top 0.254: LED3.C 56.51,50.77 R21.2
N$18  (via drill 0.35)
  Top 0.152: U$1.39 42.59,44.2 v45.4,47
  Bottom 0.152: 47.45,47.08 C10.1 | 47.45,47.08 48.32,47.08 CR2.2 48.84,46.67 U$2.C7 | v45.4,47 47.37,47 47.45,47.08
N$19  (via drill 0.35)
  Top 0.152: U$1.40 33.1,45.3 v33.2,45.2
  Bottom 0.152: U$2.C2 C9.1 34.75,44.88 CR3.2 34.43,45.2 v33.2,45.2
N$20  (via drill 0.35)
  Top 0.152: U$1.41 33.01,46.4 v33.1,46.3
  Bottom 0.152: v33.1,46.3 33.1,45.96 32.59,45.45 32.59,44.74 C12.1 34.42,43.92 CR4.2 35.48,43.82 C8.1 36.88,43.92 U$2.C1
N$21
  Top 0.152: U$1.46 32.9,51.9 33.6,52.6 34.98,52.6 R16.2
N$22
  Top 0.152: U$1.48 32.49,54.09 33.6,55.2 34.88,55.2 C18.1
N$23
  Top 0.152: U$1.49 32.4,55.2 33.7,56.5 34.88,56.5 C17.1
N$24
  Top 0.152: 36.35,52.65 R16.1 | 36.35,52.65 37.66,52.65 R15.1 R14.1 | C19.2 36.3,52.69 36.35,52.65
N$25  (via drill 0.35)
  Top 0.152: U$1.47 32.49,52.99 33.4,53.9 34.59,53.9 C19.1 | U$14.2 41.01,55.05 R17.2 40.45,53.91 v40.25,54.1
  Bottom 0.152: v40.25,54.1 37.58,54.1 37.58,54.11 34.83,54.11 C19.1
  other vias: 34.6,53.88
N$26
  Top 0.152: 40.07,52.67 R14.2 | 40.07,52.67 40.94,52.67 R17.1 | C18.2 37.28,55.22 38.7,53.8 39.7,53.8 40,53.5 40,52.74 40.07,52.67
N$27
  Top 0.152: U$13.2 37.72,51.41 R15.2 37.66,51.4 36.5,51.4 35.93,51.97 35.88,51.97 35.75,52.1 35.75,53.07 35.53,53.29 35.53,55.67 36.2,56.34 C17.2
N$28  (via drill 0.38)
  Top 0.152: C13.2 40.03,51.4 U$13.1 40.63,50.8 v44.2,50.8 | U$18.2 56.02,37.63 54.74,38.91 54.05,38.91 53.9,39.06 53.9,50.49 53.09,51.31 48.26,51.31 v47.75,50.8
  Top 0.254: U$8.1 U$18.2
  Bottom 0.152: v47.75,50.8 v44.2,50.8
N$29  (via drill 0.35, 0.38)
  Top 0.152: 39.67,55.1 U$14.1 | 39.67,55.1 39.67,56.28 C14.2 | U$1.45 32.9,50.8 v33.9,51.8 | v38.5,55.3 39.47,55.3 39.67,55.1 | U$17.2 54.78,38.44 54.61,38.61 53.85,38.61 53.59,38.86 53.59,42.42 53.34,42.67 47.24,42.67 v46.48,41.91
  Top 0.254: U$8.4 54.75,37.6 U$17.2
  Bottom 0.152: 33.9,51.88 v33.9,51.8 | 33.9,51.88 33.9,54.3 35.2,55.6 38.2,55.6 v38.5,55.3 38.57,55.37 42.42,55.37 42.93,54.86 42.93,43.18 44.2,41.91 v46.48,41.91 | C16.1 33.45,50.74 33.9,51.2 33.9,51.88
N$30  (via drill 0.35, 0.38)
  Top 0.152: U$1.44 33.3,49.7 v33.5,49.9 36.21,49.9 39.62,46.48 v39.62,45.47 | v45.21,40.64 45.21,38.23 U$16.1
  Top 0.254: U$8.2 45.35,35.76 45.35,35.95 44.8,36.5 44.8,37.82 U$16.1
  Top 0.406: U$8.3 52.74,28.04 50.04,30.73 50.04,34.04 48.51,35.56 45.55,35.56 45.35,35.76
  Bottom 0.152: v33.5,49.9 29.14,49.9 C15.1 | v39.62,45.47 39.62,42.67 40.89,41.4 44.45,41.4 v45.21,40.64
N$31
  Top 0.762: U$1.56 27.18,61.52 27.18,61.72
  Top 1.016: 27.18,63.86 C20.1
  Top 1.194: 27.18,61.72 27.18,63.86
N$32
  Top 1.016: C20.2 27.18,65.86
  Top 1.194: 27.18,65.86 U$7.1
N$33  (via drill 0.38)
  Top 0.152: R30.2 46.92,3.47 S2.1 | U$19.4 43.48,15.03 v44.4,14.1 v44.4,9.1
  Bottom 0.152: S2.1 46.89,3.6 45.2,3.6 44.4,4.4 v44.4,9.1
N$34
  Top 0.152: U$19.16 50.12,14.38 50.37,14.13 50.37,13.3 50.5,13.16 51.54,13.16 51.8,12.9 51.8,9.66 LED11.C
N$35
  Top 0.152: LED12.C 52.47,7.47 51.49,8.44 51.49,12.4 51.1,12.8 50.43,12.8 50.06,13.17 50.06,13.44 49.8,13.7 48.94,13.7 U$19.15
N$36
  Top 0.152: LED11.A R31.1
N$37
  Top 0.152: LED12.A R32.1
N$38
  Top 0.254: U$11.3 54.95,50.51 R21.1
N$39  (via drill 0.38)
  Top 0.203: U1.8 15.96,10.46 14.48,11.94 v14.48,16.51 | v13.72,38.35 13.72,42.77 R19.1
  Bottom 0.203: v14.48,16.51 14.48,37.59 v13.72,38.35
N$40
  Top 0.254: LED4.C 56.51,54.58 R23.2
N$41
  Top 0.254: U$12.3 54.95,54.32 R23.1
N$42  (via drill 0.38)
  Top 0.203: R20.1 14.94,35.61 v15.49,35.05 | v16.51,9.65 17.53,9.65 18.03,9.14 19.66,9.14 U1.9
  Bottom 0.203: v15.49,35.05 15.49,10.67 v16.51,9.65
N$43
  Top 0.152: R33.2 21.39,3.23 LED13.C
N$44
  Top 0.152: LED14.C 27.89,2.83 R36.2
N$45
  Top 0.254: R13.1 51.08,40.93 R2.1 52.16,40.97 U$9.1
N$46
  Top 0.254: R12.1 R4.1 52.25,46.13 U$10.1
N$47
  Top 0.152: U2.8 21.75,22.72 R40.2
N$48
  Top 0.152: U2.7 20.29,24.29 20.1,24.1 20.1,23.67 R39.2
N$49
  Top 0.152: U2.9 27.38,22.72 R41.2
N$50
  Top 0.254: R11.1 R22.1 52.25,49.95 U$11.1
N$51
  Top 0.254: R10.1 R24.1 52.25,53.76 U$12.1
POWER_IN  (via drill 0.35)
  Top 0.152: LED1.A LED2.A LED3.A LED4.A 58.61,57.79 56.1,60.3 41.9,60.3 v40.5,58.9 | U$23.1 6.62,28.71 6.86,28.96 7.11,28.96 7.2,29.04 7.94,29.04 8.03,28.96 8.38,28.96 8.38,28.35 U$23.3
  Top 0.406: C28.1 6.92,26.78 6.6,27.1 | 6.6,27.1 6.6,28.2 U$23.1 | C1.1 8.52,24.26 U$3.1 8.5,22.57 8.5,21.5 8.4,21.4 6.9,21.4 6.62,21.68 U$3.3 6.6,22.6 6.6,23.5 5.5,24.6 | 6.12,27.58 6.6,27.1 | C21.2 38.06,58.9 36,58.9 35.56,59.34 C22.2 35.36,60.31 C23.2 C24.2 31.7,60.3 31,59.59 U$1.53 U$1.52 U$1.51 32.6,57.4 32.97,57.77 C25.2
  Top 0.508: U$6.3 5.5,27.58 | 5.5,27.58 6.12,27.58 | 5.5,27.58 5.5,24.6
  Top 0.61: v40.5,58.9 38.06,58.9
  Bottom 0.61: U$6.3 3.78,27.58 4.8,28.6 4.8,57.2 6.4,58.8 40.4,58.8 v40.5,58.9
POWER_ON  (via drill 0.38)
  Top 0.152: U$1.15 14.36,44.2 R19.2
  Top 0.406: R18.1 10.54,61.67 S6.4 S6.3
  Bottom 0.203: S6.3 13.16,55.17 14.48,53.85 14.48,44.83 R19.2
  other vias: 13.79,44.14
RESET_N  (via drill 0.38)
  Top 0.152: R20.2 16.89,40.87 U$1.18
  Top 0.203: R20.2 14.94,42.62 v14.99,42.67 | v8.13,47.75 3.05,47.75 2.29,46.99 2.29,45.11 S1.1
  Bottom 0.203: v14.99,42.67 13.21,42.67 v8.13,47.75
RESETN
  Top 0.152: U1.14 27.63,11.73 27.4,11.5 27.4,7.3 27.2,7.1 9.29,7.1 | 9.29,7.1 9.2,7.1 8.7,7.6 8.7,9.83 8.68,9.85 | 8.68,9.85 S3.3 | JP1.3 8.67,9.84 8.68,9.85 | S3.4 8.66,6.47 9.29,7.1
RTS_
  Top 0.152: R25.1 14.23,50.16 14.7,49.7 U$1.10
RX_
  Top 0.152: R28.1 16.89,46.35 U$1.13
RX_18  (via drill 0.35)
  Top 0.152: R27.2 10.82,47.62 10.4,47.2 10.4,46.2 11.11,45.49 11.11,34.06 13.37,31.8 23.27,31.8 24.89,30.17 24.89,25.11 v25.1,24.9 | v29.6,25.6 27.39,25.6 U2.12
  Bottom 0.152: v25.1,24.9 28.9,24.9 v29.6,25.6
RX_33
  Top 0.152: JP2.2 11.32,18.08 U1.2 19.73,18.1 21.7,18.1 23.2,19.61 23.2,24.83 22.44,25.59 U2.5
SCK  (via drill 0.35)
  Top 0.152: U1.16 27.37,14.27 26.9,13.8 26.9,8.1 26.2,7.41 22.8,7.41 v22.4,7.8
  Bottom 0.152: v22.4,7.8 21.4,7.8 20.5,6.9 8,6.9 6,4.9 6,2.7 5.4,2.1 2.77,2.1 JP1.6
TX_
  Top 0.152: R27.1 16.8,47.62 U$1.12
TX_18
  Top 0.152: R28.2 11.41,34.19 13.5,32.1 23.4,32.1 25.2,30.3 25.2,25.7 25.9,25 27.32,25 U2.11
TX_33
  Top 0.152: JP2.3 12.59,19.35 U1.1 19.75,19.4 22.3,19.4 22.9,20 22.9,24.7 22.66,24.94 U2.6
USB_CTS  (via drill 0.35)
  Top 0.152: U1.5 22.77,14.27 23.2,14.7 23.2,17.8 v22.73,18.27 | v47.2,12.1 47.3,12.1 47.6,12.4 48.88,12.4 U$19.13
  Bottom 0.152: v22.73,18.27 22.73,18.83 23,19.1 31.16,19.1 32.7,17.55 32.7,12.2 33.19,11.71 46.81,11.71 v47.2,12.1
USB_DM
  Top 0.254: 50.95,15.68 U$19.18 | 50.95,15.68 55.7,15.68 U$5.P$2 | CR5.2 50.95,15.67 50.95,15.68
USB_DP
  Top 0.254: 51.02,16.32 U$19.19 | 51.02,16.32 55.7,16.32 U$5.P$3 | CR6.2 51,16.34 51.02,16.32
USB_RTS  (via drill 0.35)
  Top 0.152: U1.4 22.46,15.54 v22.2,15.4 | v46.2,10 47.3,10 48.42,11.12 U$19.11
  Bottom 0.152: v22.2,15.4 23.94,15.4 25.65,17.11 27.27,17.11 28.02,16.36 28.02,11.78 28.7,11.1 33.7,11.1 34.8,10 v46.2,10
V_BCKP
  Top 0.406: R18.2 14.14,58.62 C26.1 16.82,58.59 U$1.2
VBAT
  Top 0.406: U$6.2
  Top 0.61: CN1.2 1.82,21.38 1.3,21.9 1.3,28.8 2.1,29.6 U$6.2
VBAT_CHARGE
  Top 0.406: U$4.3 5.67,36.33 C33.1 5.33,35.98 5.33,32.77 4.16,31.59 U$6.1
VUSB  (via drill 0.35, 0.38)
  Top 0.152: R31.2 R32.2 R29.1 R7.1 58,2.87 58,1.7 57.39,1.09 45.81,1.09 45.62,1.27 R30.1 | U$19.17 47.48,15.03 v46.4,16.1
  Top 0.254: v43.5,18 42.95,18 U$19.1 | v52.58,14.73 52.8,14.96 U$5.P$1 56.93,14.96 57.15,14.73 57.15,9.82 R31.2
  Top 0.406: v1.39,34.8 1.94,35.35 2.08,35.35 2.29,35.56 R5.2 | v1.78,42.16 3.21,42.16 3.8,42.76 4.79,42.76 5,42.55 5,42.54 C34.1 5.67,41.87 U$4.4 8.94,40.09 v9.4,39.62
  Bottom 0.152: v46.4,16.1 45.55,16.1 45.28,15.84
  Bottom 0.254: C4.1 46.76,15.04 | C4.1 45.28,15.84 44.47,16.65 C6.1 43.82,17.68 v43.5,18 | v52.58,14.73 46.45,14.73 C4.1
  Bottom 0.406: v1.39,34.8 1.39,41.78 v1.78,42.16 | v9.4,39.62 13.72,39.62 17.27,36.07 17.27,33.53 17.78,33.02 31.5,33.02 34.8,29.72 34.8,26.7 v43.5,18

### Text on the board
tPlace: START | GPIO4 | GPIO3 | !RESET | GPIO2 | GPIO1 | OFF | ON | TX | RX | GND | GND | VCC | RST | MOSI | MISO | SCK